# EAGLE design FT232 (EAGLE 7.2.0)
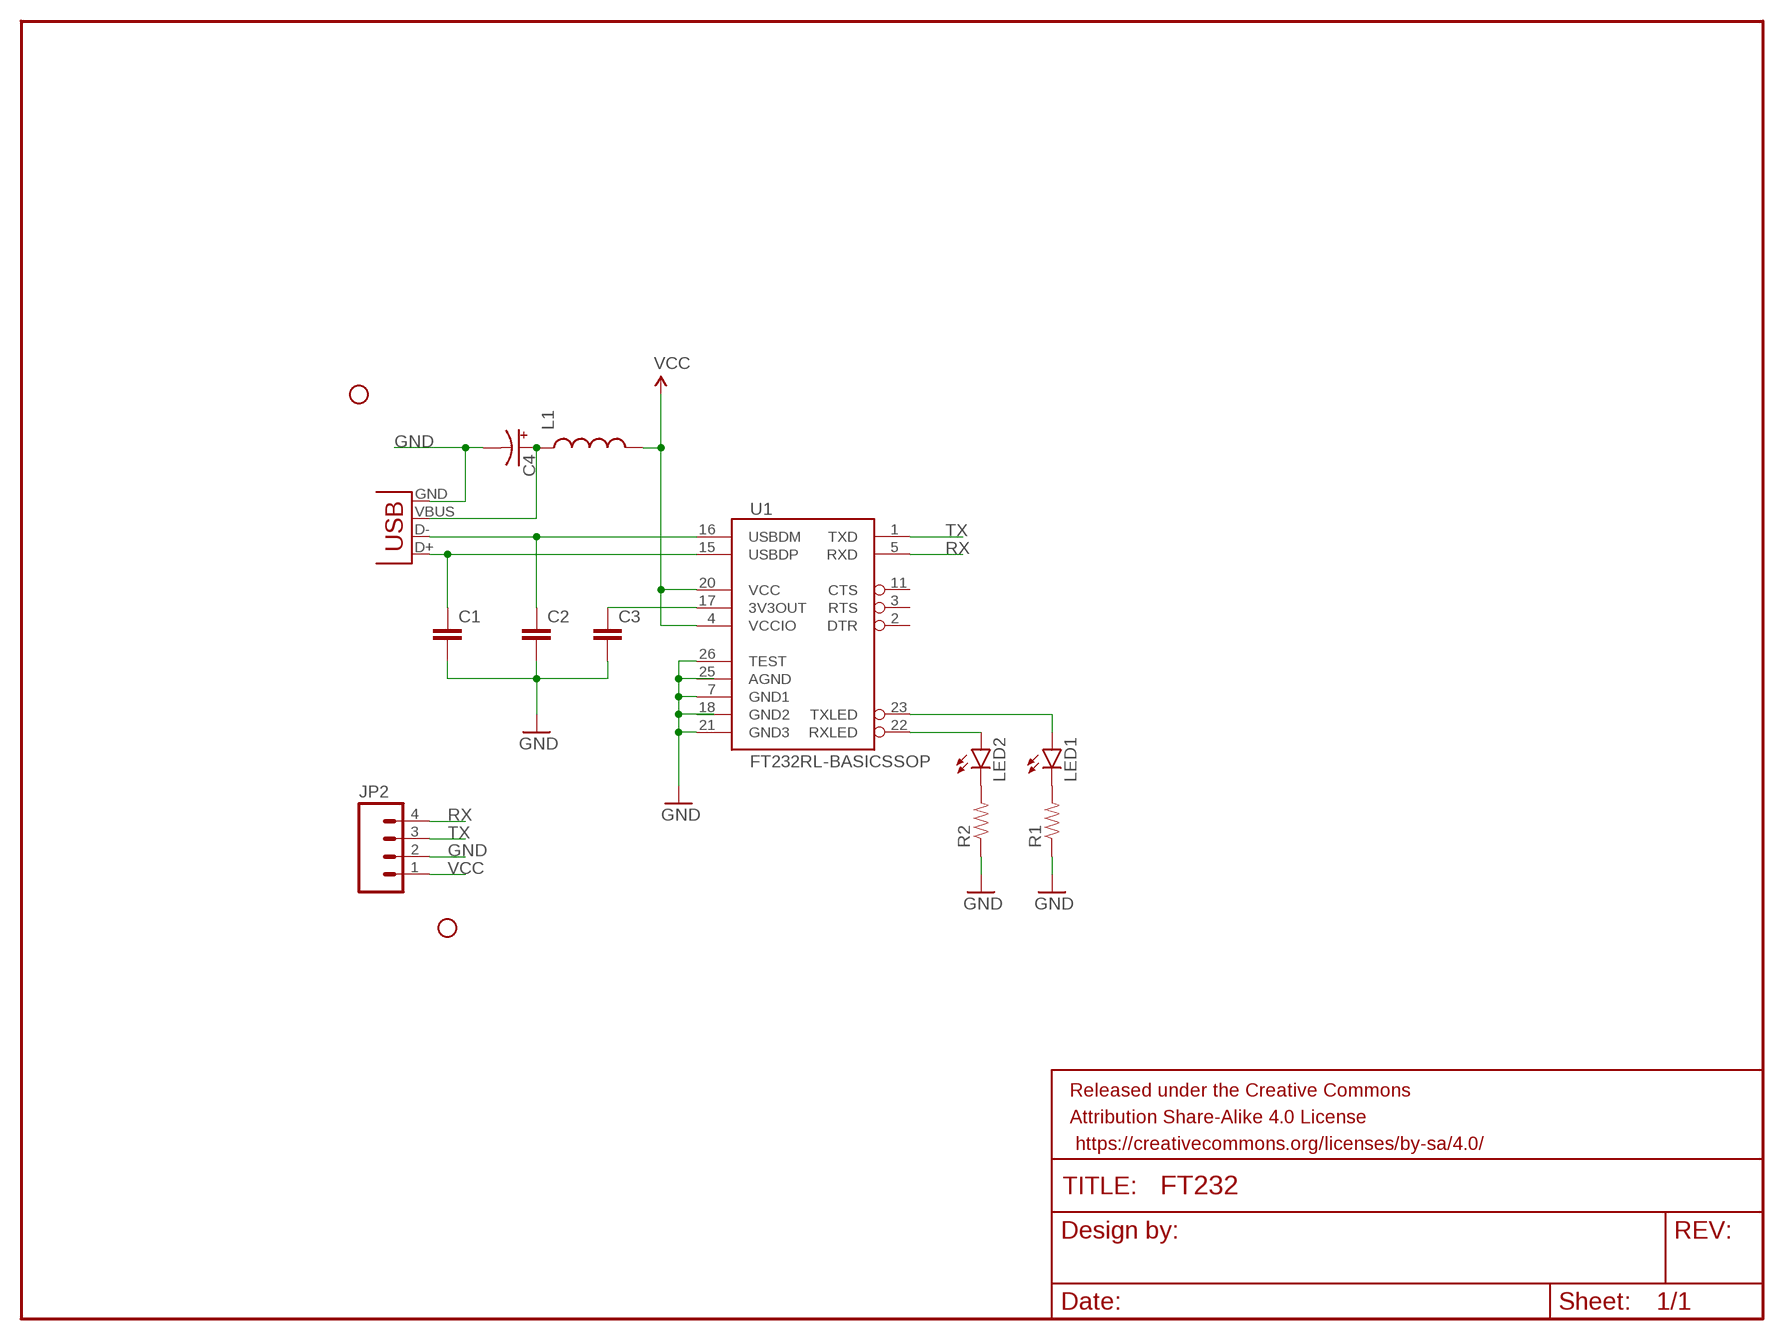
[diagram p0: schematic, sheet 1]

## Parts
C1  CAP0603-CAP  [0603-CAP]
C2  CAP0603-CAP  [0603-CAP]
C3  CAP0603-CAP  [0603-CAP]
C4  CAP_POL1206  [EIA3216]
FRAME1  FRAME-LETTER  [CREATIVE_COMMONS]
JP1  USB-B  USBPTH  [USB-B-PTH]
JP2  M04PTH  [1X04]
L1  INDUCTOR0603  [0603]
LED1  LED5MM  [LED5MM]
LED2  LED5MM  [LED5MM]
R1  RESISTORPTH-1/4W  [AXIAL-0.4]
R2  RESISTORPTH-1/4W  [AXIAL-0.4]
STANDOFF1  STAND-OFF  [STAND-OFF]
STANDOFF3  STAND-OFF  [STAND-OFF]
U1  FT232RL-BASICSSOP  [SSOP28DB]

## Nets
GND: C1.2 C2.2 C3.2 C4.C(-) JP1.GND JP2.2 R1.P$1 R2.P$1 U1.7(GND1) U1.21(GND3) U1.26(TEST)
N$1: C2.1 JP1.D- U1.16(USBDM)
N$2: C3.1 U1.17(3V3OUT)
N$3: C4.A(+) JP1.VBUS L1.1
N$4: C1.1 JP1.D+ U1.15(USBDP)
N$5: LED1.K(C) R1.P$2
N$6: LED2.K(C) R2.P$2
N$7: LED2.A U1.22(RXLED)
N$8: LED1.A U1.23(TXLED)
RX: JP2.4 U1.5(RXD)
TX: JP2.3 U1.1(TXD)
VCC: JP2.1 L1.2 U1.4(VCCIO) U1.20(VCC)
Unconnected: U1.2(DTR) U1.3(RTS) U1.11(CTS)

## Power pins joined to a net without a drawn wire
AGND: U1.25(AGND)
GND2: U1.18(GND2)

## Library data of the parts
C1-C3 = SparkFun-Capacitors:CAP: Capacitor Standard 0603 ceramic capacitor, and 0.1" leaded capacitor.
C4 = SparkFun-Capacitors:CAP_POL: Capacitor Polarized These are standard SMD and PTH capacitors. Normally 10uF, 47uF, and 100uF in electrolytic and tantalum varieties. Always verify the external diameter of the through hole cap, it varies with capacity, voltage, and manufacturer. The EIA devices should be standard.
FRAME1 = SparkFun-Aesthetics:FRAME-LETTER: Schematic Frame Standard 8.5x11 US Letter frame
JP1 = SparkFun-Connectors:USB: USB Connectors USB-B-PTH is fully proven SKU : PRT-00139/CONN-08278 USB-miniB is fully proven SKU : PRT-00587 USB-A-PCB is untested. USB-A-H is throughly reviewed, but untested. Spark Fun Electronics SKU : PRT-00437 USB-B-SMT is throughly reviewed, but untested. Needs silkscreen touching up. USB-A-S has not been used/tested USB-MB-H has not been used/tested USB-MICROB has been used. CONN-09505; PROD_ID: CONN-08278
JP2 = SparkFun-Connectors:M04: Header 4 Standard 4-pin 0.1" header. Use with straight break away headers (SKU : PRT-00116), right angle break away headers (PRT-00553), swiss pins (PRT-00743), machine pins (PRT-00117), and female headers (PRT-00115). Molex polarized connector foot print use with SKU : PRT-08231 with associated crimp pins and housings. 1MM SMD Version SKU: PRT-10208
L1 = SparkFun-Passives:INDUCTOR: Inductors Basic Inductor/Choke - 0603 and 1206. Footprints are not proven and vary greatly between part numbers. SRN6045- 33uH, 20% 1.4A SDR0403-560KL - 56uH, 10%, 500mA RMS/740mA peak
LED1 LED2 = SparkFun-LED:LED: LEDs Standard schematic elements and footprints for 5mm, 3mm, 1206, and 0603 sized LEDs. 5mm - Spark Fun Electronics SKU : COM-00529 (and others)
R1 R2 = SparkFun-Resistors:RESISTOR: Resistor Basic schematic elements and footprints for 0603, 1206, and PTH resistors.
STANDOFF1 STANDOFF3 = SparkFun-Electromechanical:STAND-OFF: #4 Stand Off This is the mechanical footprint for a #4 phillips button head screw. Use the keepout ring to avoid running the screw head into surrounding components. SKU : PRT-00447
U1 = SparkFun-DigitalIC:FT232RL-BASIC: USB UART This is the simplified version of the FT232RL unit. Only what you need, nothing you don't. Spark Fun Electronics SKU : COM-00650

## Board
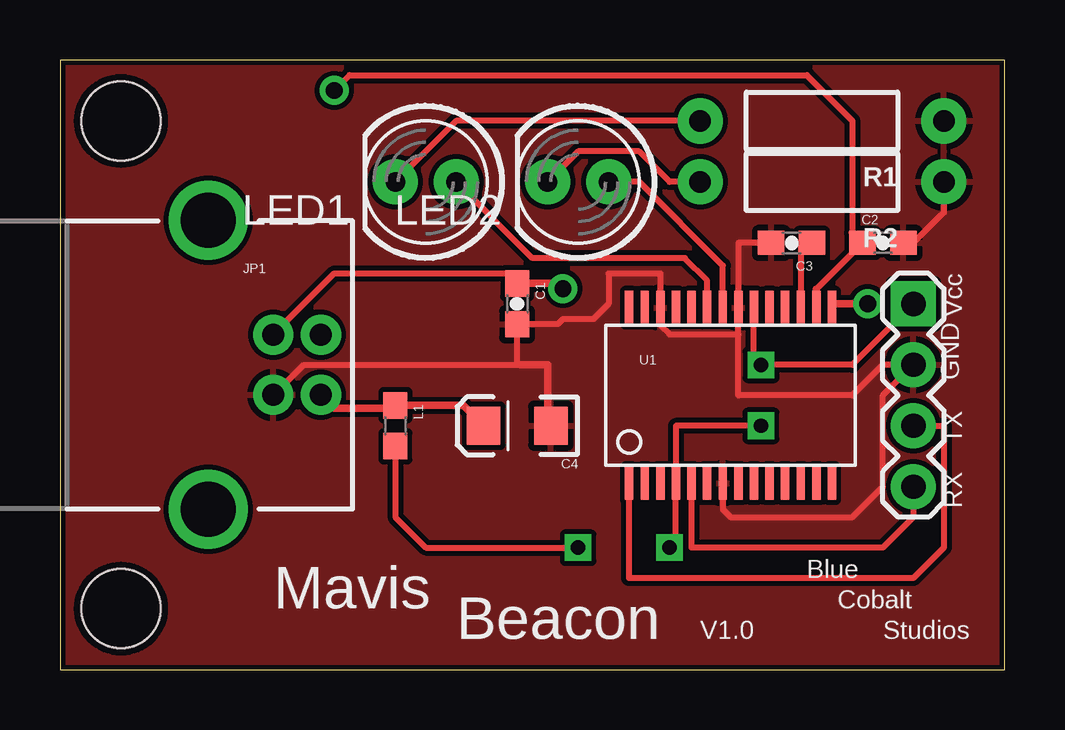
[diagram p1: board, top side]
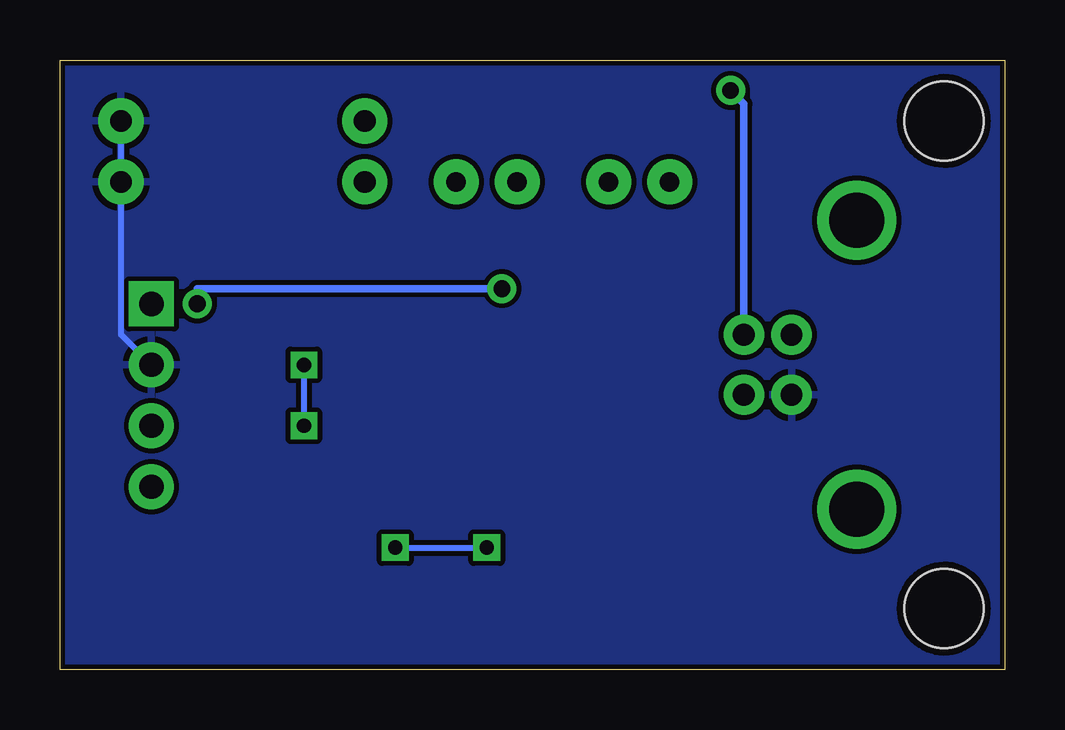
[diagram p2: board, bottom side, seen from below]

Size 39.37 x 25.4 mm. Coordinates in mm from the lower left corner, seen from the top.
Outline: 0,0 39.37,0 39.37,25.4 0,25.4 0,0
Copper layers (1*16): Top 0.035mm / dielectric 1.5mm / Bottom 0.035mm
Design rules "SparkFun": minimum track width 8mil, minimum drill 20mil, track to track 8mil, track to pad 8mil, pad to pad 8mil, via to via 8mil, smd to smd 8mil, copper to edge 8mil, drill to drill 8mil, minimum pad ring 12mil, minimum via ring 10mil, stop-mask expansion 4mil, vias tented up to drill 20mil, thermal gap 10mil

### Footprints (pad centres in the part's own frame; a part is rotated, then mirrored left to right if it is on the bottom)
0603-CAP = smd 1.1 x 1: 1 -0.85,0; 2 0.85,0
EIA3216 = smd 1.4 x 1.6: A 1.4,0; C -1.4,0
USB-B-PTH = drill 0.914 pad 1.676: D+ 0,1.25; D- 1.981,1.25; GND 0,-1.25; VBUS 1.981,-1.25 | drill 2.286: S1 -2.718,-6.02; S2 -2.718,6.02
1X04 = drill 1.016 pad 1.88 square: 1 0,0 | drill 1.016 pad 1.88: 2 2.54,0; 3 5.08,0; 4 7.62,0
0603 = smd 1.1 x 1: 1 -0.85,0; 2 0.85,0
LED5MM = drill 0.813 pad 1.88: A -1.27,0; K 1.27,0
AXIAL-0.4 = drill 0.9 pad 1.88: P$1 -5.08,0; P$2 5.08,0
STAND-OFF = hole 3.302: 0,0
SSOP28DB = smd 0.348 x 1.397: 1 -4.225,-3.656; 2 -3.575,-3.656; 3 -2.925,-3.656; 4 -2.275,-3.656; 5 -1.625,-3.656; 6 -0.975,-3.656; 7 -0.325,-3.656; 8 0.325,-3.656; 9 0.975,-3.656; 10 1.625,-3.656; 11 2.275,-3.656; 12 2.925,-3.656; 13 3.575,-3.656; 14 4.225,-3.656; 15 4.225,3.656; 16 3.575,3.656; 17 2.925,3.656; 18 2.275,3.656; 19 1.625,3.656; 20 0.975,3.656; 21 0.325,3.656; 22 -0.325,3.656; 23 -0.975,3.656; 24 -1.625,3.656; 25 -2.275,3.656; 26 -2.925,3.656; 27 -3.575,3.656; 28 -4.225,3.656

### Placement (x,y rotation side)
C1  19.05,15.24 270 top
C2  34.29,17.78 0 top
C3  30.48,17.78 180 top
C4  19.05,10.16 180 top
FRAME1  -77.47,16.51 0 top  (outside the outline)
JP1  8.89,12.7 0 top
JP2  35.56,15.24 270 top
L1  13.97,10.16 270 top
LED1  15.24,20.32 180 top
LED2  21.59,20.32 180 top
R1  31.75,22.86 180 top
R2  31.75,20.32 180 top
STANDOFF1  2.54,2.54 0 top
STANDOFF3  2.54,22.86 0 top
U1  27.94,11.43 0 top

### Tracks (layer width: path | path; a pad name or v marks a point on that pad's centre or on a via)
GND
  Top 0.254: U1.7 27.61,6.68 27.94,6.35 33.02,6.35 34.29,7.62 34.29,11.43 JP2.2 34.29,12.7 33.02,11.43 28.27,11.43 28.27,13.97 | 28.27,13.97 U1.21 28.27,17.78 C3.2 | JP1.GND 8.91,11.45 10.16,12.7 19.05,12.7 | 19.18,12.7 19.05,12.7 | 19.05,12.7 C1.2 20.74,14.39 20.95,14.61 22.23,14.61 22.86,15.24 22.86,16.51 25.02,16.51 U1.26 25.02,14.36 25.4,13.97 28.27,13.97 | R2.P$1 36.83,19.05 35.56,17.78 C2.2
  Top 0.305: 19.18,12.7 20.32,12.7 20.32,10.29 C4.C
  Bottom 0.254: R1.P$1 R2.P$1 36.83,13.97 JP2.2
  pour Top: 0,25.4 0,0 39.37,0 39.37,25.4
  pour Bottom: 0,25.4 0,0 39.37,0 39.37,1.27 39.37,25.4
N$1  (via drill 0.7)
  Top 0.254: v11.43,24.13 12.06,24.77 31.11,24.77 33.02,22.86 33.02,18.2 | C2.1 31.52,15.86
  Top 0.305: U1.16 31.52,15.86 | 33.02,18.2 C2.1
  Bottom 0.305: JP1.D- 10.87,23.57 v11.43,24.13
N$2
  Top 0.254: C3.1 30.86,17.78 U1.17
N$3
  Top 0.254: 11.43,10.89 JP1.VBUS
  Top 0.305: 11.43,10.89 13.85,10.89 L1.1 16.8,11.01 C4.A
N$4  (via drill 0.7)
  Top 0.254: JP1.D+ 8.89,13.97 11.43,16.51 18.63,16.51 C1.1
  Top 0.305: C1.1 20.95,16.09 v20.95,15.88 | v33.66,15.24 32.16,15.24 U1.15
  Bottom 0.305: v20.95,15.88 33.66,15.88 v33.66,15.24
N$5
  Top 0.254: R1.P$2 16.51,22.86 LED1.K
N$6
  Top 0.254: R2.P$2 25.4,20.32 24.13,21.59 21.59,21.59 LED2.K
N$7
  Top 0.254: LED2.A 24.13,20.32 27.61,16.84 U1.22
N$8
  Top 0.254: LED1.A 19.68,17.14 26.04,17.14 26.96,16.21 U1.23
RX
  Top 0.254: JP2.4 35.56,6.35 34.29,5.08 26.32,5.08 U1.5
TX
  Top 0.254: JP2.3 36.83,10.16 36.83,5.08 35.56,3.81 23.71,3.81 U1.1
VCC  (via drill 0.6)
  Top 0.254: JP2.1 33.02,12.7 v29.21,12.7 28.91,12.7 U1.20 | v29.21,10.16 25.66,10.16 U1.4 25.66,5.08 v25.4,5.08 | L1.2 13.97,6.35 15.24,5.08 v21.59,5.08
  Bottom 0.254: v29.21,12.7 v29.21,10.16 | v25.4,5.08 v21.59,5.08

### Text on the board
tPlace: Vcc | GND | TX | RX | Blue | Mavis | Cobalt | Beacon | V1.0 | Studios